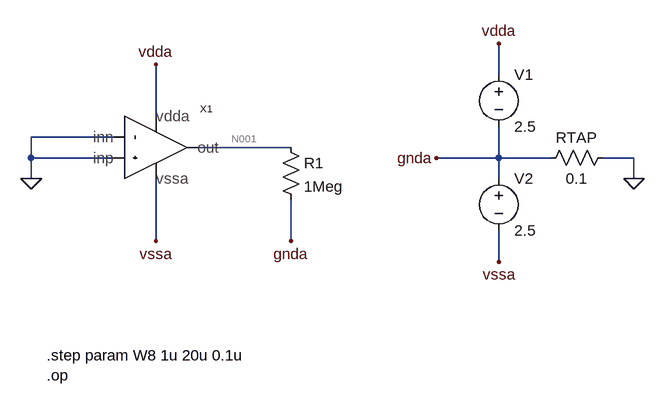
[diagram p0: schematic opamp-top.asc]
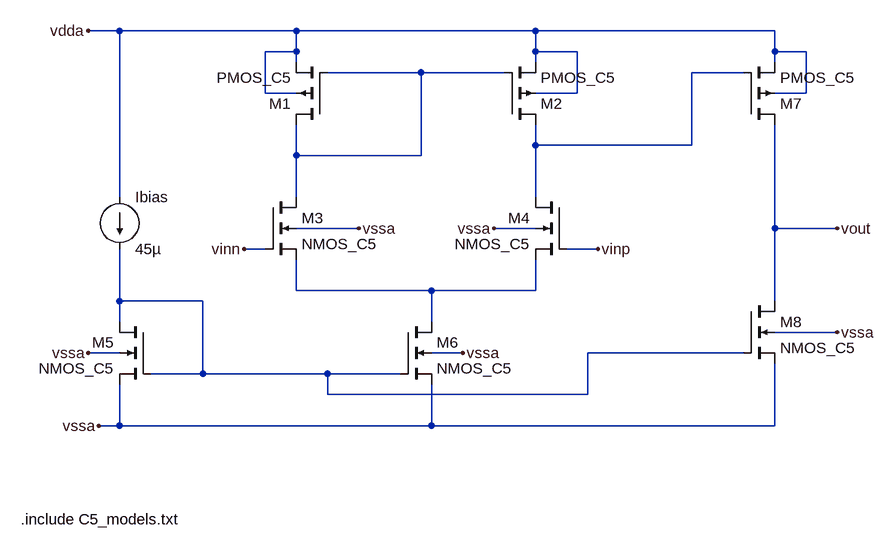
[diagram p1: sub-circuit opamp-schem.asc]
opamp-top.asc, the LTspice schematic file:
Version 4.1
SHEET 1 996 680
WIRE 656 -160 656 -208
WIRE 128 -96 128 -176
WIRE 64 -64 -64 -64
WIRE 336 -48 192 -48
WIRE -64 -32 -64 -64
WIRE 64 -32 -64 -32
WIRE 656 -32 656 -80
WIRE 656 -32 560 -32
WIRE 736 -32 656 -32
WIRE 864 -32 816 -32
WIRE -64 0 -64 -32
WIRE 656 0 656 -32
WIRE 864 0 864 -32
WIRE 128 96 128 0
WIRE 336 96 336 32
WIRE 656 128 656 80
FLAG -64 0 0
FLAG 336 96 gnda
FLAG 128 96 vssa
FLAG 128 -176 vdda
FLAG 864 0 0
FLAG 560 -32 gnda
FLAG 656 -208 vdda
FLAG 656 128 vssa
SYMBOL opamp-schem 112 -48 R0
SYMATTR InstName X1
SYMBOL res 320 -64 R0
SYMATTR InstName R1
SYMATTR Value 1Meg
SYMBOL voltage 656 -176 R0
WINDOW 123 0 0 Left 0
WINDOW 39 0 0 Left 0
SYMATTR InstName V1
SYMATTR Value 2.5
SYMBOL voltage 656 -16 R0
WINDOW 123 0 0 Left 0
WINDOW 39 0 0 Left 0
SYMATTR InstName V2
SYMATTR Value 2.5
SYMBOL res 832 -48 R90
WINDOW 0 0 56 VBottom 2
WINDOW 3 32 56 VTop 2
SYMATTR InstName RTAP
SYMATTR Value 0.1
TEXT -40 272 Left 2 !.step param W8 1u 20u 0.1u\n.op

opamp-schem.asc, the sub-circuit schematic file:
Version 4.1
SHEET 1 880 960
WIRE -512 -16 -560 -16
WIRE -240 -16 -512 -16
WIRE 128 -16 -240 -16
WIRE 496 -16 128 -16
WIRE -240 16 -240 -16
WIRE -240 16 -288 16
WIRE 128 16 128 -16
WIRE 192 16 128 16
WIRE 496 16 496 -16
WIRE 544 16 496 16
WIRE -240 32 -240 16
WIRE 128 32 128 16
WIRE 496 32 496 16
WIRE -48 48 -192 48
WIRE 80 48 -48 48
WIRE 448 48 368 48
WIRE -288 80 -288 16
WIRE -240 80 -288 80
WIRE 192 80 192 16
WIRE 192 80 128 80
WIRE 544 80 544 16
WIRE 544 80 496 80
WIRE 128 160 128 128
WIRE 368 160 368 48
WIRE 368 160 128 160
WIRE -240 176 -240 128
WIRE -48 176 -48 48
WIRE -48 176 -240 176
WIRE -512 240 -512 -16
WIRE -240 240 -240 176
WIRE 128 240 128 160
WIRE -144 288 -240 288
WIRE 128 288 64 288
WIRE 496 288 496 128
WIRE 592 288 496 288
WIRE -288 320 -320 320
WIRE 224 320 176 320
WIRE -240 384 -240 336
WIRE -32 384 -240 384
WIRE 128 384 128 336
WIRE 128 384 -32 384
WIRE -512 400 -512 320
WIRE -384 400 -512 400
WIRE 496 400 496 288
WIRE -512 432 -512 400
WIRE -32 432 -32 384
WIRE 592 448 496 448
WIRE -512 480 -560 480
WIRE 16 480 -32 480
WIRE 448 480 208 480
WIRE -384 512 -384 400
WIRE -384 512 -464 512
WIRE -192 512 -384 512
WIRE -80 512 -192 512
WIRE -192 544 -192 512
WIRE 208 544 208 480
WIRE 208 544 -192 544
WIRE -512 592 -512 528
WIRE -512 592 -544 592
WIRE -32 592 -32 528
WIRE -32 592 -512 592
WIRE 496 592 496 496
WIRE 496 592 -32 592
FLAG -560 -16 vdda
FLAG -544 592 vssa
FLAG -560 480 vssa
FLAG 16 480 vssa
FLAG 592 448 vssa
FLAG -320 320 vinn
FLAG 224 320 vinp
FLAG 592 288 vout
FLAG -144 288 vssa
FLAG 64 288 vssa
SYMBOL current -512 240 R0
WINDOW 123 0 0 Left 0
WINDOW 39 0 0 Left 0
SYMATTR InstName Ibias
SYMATTR Value 45µ
SYMBOL pmos4 -192 128 R180
SYMATTR InstName M1
SYMATTR Value PMOS_C5
SYMATTR Value2 l=0.5µ w=10µ
SYMBOL pmos4 80 128 M180
SYMATTR InstName M2
SYMATTR Value PMOS_C5
SYMATTR Value2 l=0.5µ w=10µ
SYMBOL nmos4 -288 240 R0
SYMATTR InstName M3
SYMATTR Value NMOS_C5
SYMATTR Value2 l=0.5µ w=5µ
SYMBOL nmos4 176 240 M0
SYMATTR InstName M4
SYMATTR Value NMOS_C5
SYMATTR Value2 l=0.5µ w=5µ
SYMBOL pmos4 448 128 M180
SYMATTR InstName M7
SYMATTR Value PMOS_C5
SYMATTR Value2 l=0.5µ w=18.781214µ
SYMBOL nmos4 -80 432 R0
SYMATTR InstName M6
SYMATTR Value NMOS_C5
SYMATTR Value2 l=0.5µ w=5µ
SYMBOL nmos4 -464 432 M0
SYMATTR InstName M5
SYMATTR Value NMOS_C5
SYMATTR Value2 l=0.5µ w=5µ
SYMBOL nmos4 448 400 R0
SYMATTR InstName M8
SYMATTR Value NMOS_C5
SYMATTR Value2 l=0.5µ w=5.75µ
TEXT -664 736 Left 2 !.include C5_models.txt

The netlist it stands for:
* opamp-top.asc
X§X1 N001 0 0 vdda vssa opamp-schem
R1 N001 gnda 1Meg
V1 vdda gnda 2.5
V2 gnda vssa 2.5
RTAP 0 gnda 0.1

* block symbol definitions
.subckt opamp-schem vout vinp vinn vdda vssa
Ibias vdda N004 45µ
M1 N001 N001 vdda vdda PMOS_C5 l=0.5µ w=10µ
M2 N002 N001 vdda vdda PMOS_C5 l=0.5µ w=10µ
M3 N001 vinn N003 vssa NMOS_C5 l=0.5µ w=5µ
M4 N002 vinp N003 vssa NMOS_C5 l=0.5µ w=5µ
M7 vout N002 vdda vdda PMOS_C5 l=0.5µ w=18.781214µ
M6 N003 N004 vssa vssa NMOS_C5 l=0.5µ w=5µ
M5 N004 N004 vssa vssa NMOS_C5 l=0.5µ w=5µ
M8 vout N004 vssa vssa NMOS_C5 l=0.5µ w=5.75µ
.include C5_models.txt
.ends opamp-schem

.model NMOS NMOS
.model PMOS PMOS
.lib standard.mos
.step param W8 1u 20u 0.1u
.op
.backanno
.end

* Results of the author's LTspice run, read from the files saved beside the schematic
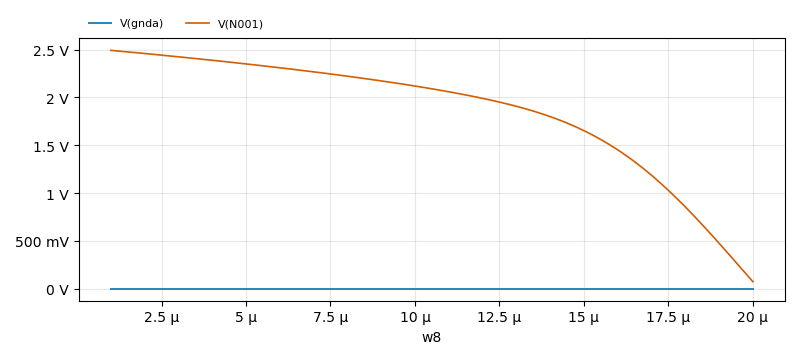
[diagram p2: Operating Point of opamp-top.asc, plotted from the saved traces]
* Operating Point, 1 run:
*   V(gnda): -0.0004337 fV at w8=1 µ, 0.0004879 fV at w8=20 µ, min -0.0008132 fV, max 0.0007589 fV
*   V(N001): 2.491 V at w8=1 µ, 73.86 mV at w8=20 µ, min 73.86 mV, max 2.491 V